# EAGLE design LSM303 breakout board-v12 (EAGLE 5.04)
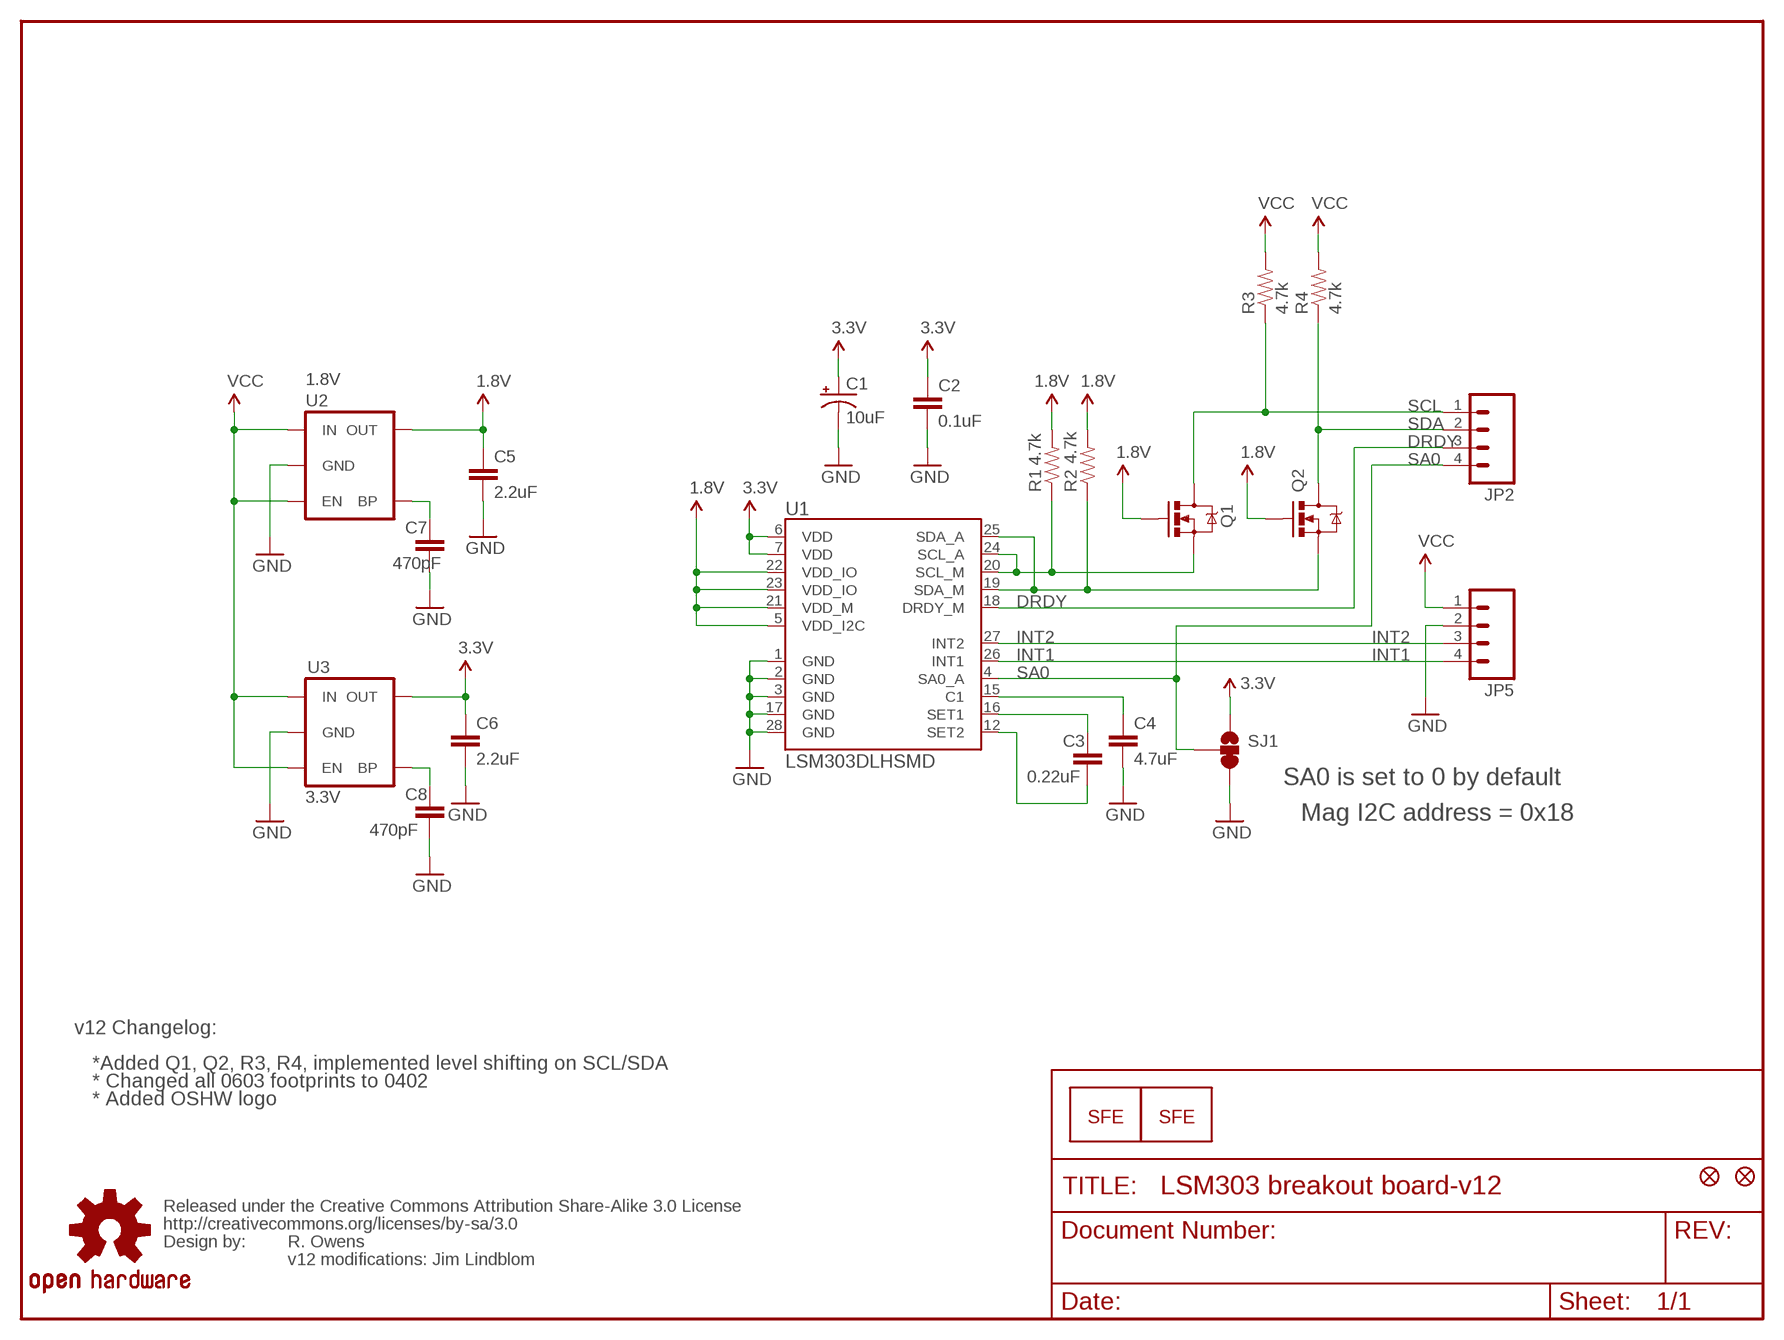
[diagram p0: schematic, sheet 1]

## Parts
C1  10uF  CAP_POL1206  [EIA3216]
C2  0.1uF  CAP0402-CAP  [0402-CAP]
C3  0.22uF  CAP0402-CAP  [0402-CAP]
C4  4.7uF  CAP0402-CAP  [0402-CAP]
C5  2.2uF  CAP0402-CAP  [0402-CAP]
C6  2.2uF  CAP0402-CAP  [0402-CAP]
C7  470pF  CAP0402-CAP  [0402-CAP]
C8  470pF  CAP0402-CAP  [0402-CAP]
JP1  LOGO-SFENW2  [SFE-NEW-WEB]
JP2  M04PTH  [1X04]
JP3  FIDUCIAL1X2  [FIDUCIAL-1X2]
JP4  FIDUCIAL1X2  [FIDUCIAL-1X2]
JP5  M04PTH  [1X04]
JP6  LOGO-SFESK  [SFE-LOGO-FLAME]
Q1  MOSFET-N-CH  MOSFET-NCHANNELSMD  [SOT23-3]
Q2  MOSFET-N-CH  MOSFET-NCHANNELSMD  [SOT23-3]
R1  4.7k  RESISTOR0402-RES  [0402-RES]
R2  4.7k  RESISTOR0402-RES  [0402-RES]
R3  4.7k  RESISTOR0402-RES  [0402-RES]
R4  4.7k  RESISTOR0402-RES  [0402-RES]
SJ1  SOLDERJUMPER_2WAYPASTE2&3  [SJ_3_PASTE2&3]
U1  LSM303DLHSMD  [LGA28-5X5]
U2  1.8V  V_REG_LDOSMD2  [SC70]
U3  3.3V  V_REG_LDOSMD  [SOT23-5]
U$5  CREATIVE_COMMONS  [CREATIVE_COMMONS]
U$8  OSHW-LOGOS  [OSHW-LOGO-S]

## Nets
1.8V: C5.1 Q1.1(G) Q2.1(G) R1.2 R2.2 U1.5(VDD_I2C) U1.21(VDD_M) U1.22(VDD_IO) U1.23(VDD_IO) U2.5(OUT)
3.3V: C1.A(+) C2.1 C6.1 SJ1.1 U1.6(VDD) U1.7(VDD) U3.5(OUT)
DRDY: JP2.3 U1.18(DRDY_M)
GND: C1.C(-) C2.2 C4.2 C5.2 C6.2 C7.2 C8.2 JP5.2 SJ1.3 U1.1(GND) U1.2(GND) U1.3(GND) U1.17(GND) U1.28(GND) U2.2(GND) U3.2(GND)
INT1: JP5.4 U1.26(INT1)
INT2: JP5.3 U1.27(INT2)
N$6: C7.1 U2.4(BP)
N$7: C8.1 U3.4(BP)
N$10: C3.1 U1.16(SET1)
N$11: C3.2 U1.12(SET2)
N$12: C4.1 U1.15(C1)
SA0: JP2.4 SJ1.2 U1.4(SA0_A)
SCL: JP2.1 Q1.3(D) R3.1
SCL_M: Q1.2(S) R1.1 U1.20(SCL_M) U1.24(SCL_A)
SDA: JP2.2 Q2.3(D) R4.1
SDA_M: Q2.2(S) R2.1 U1.19(SDA_M) U1.25(SDA_A)
VCC: JP5.1 R3.2 R4.2 U2.1(IN) U2.3(EN) U3.1(IN) U3.3(EN)

## Notes on the sheet
- SA0 is set to 0 by default
- Mag I2C address = 0x18
- v12 Changelog:
- *Added Q1, Q2, R3, R4, implemented level shifting on SCL/SDA
- * Changed all 0603 footprints to 0402
- * Added OSHW logo
- R. Owens
- v12 modifications: Jim Lindblom

## Library data of the parts
C1 = SparkFun:CAP_POL: Capacitor Polarized These are standard SMD and PTH capacitors. Normally 10uF, 47uF, and 100uF in electrolytic and tantalum varieties. Always verify the external diameter of the through hole cap, it varies with capacity, voltage, and manufacturer. The EIA devices should be standard.
C2-C8 = SparkFun:CAP: Capacitor Standard 0603 ceramic capacitor, and 0.1" leaded capacitor.
JP1 JP6 = SparkFun:LOGO-SFE: Spark Fun Electronics PCB Logo This is the standard Spark Fun Electronics PCB logo.
JP2 JP5 = SparkFun:M04: Header 4 Standard 4-pin 0.1" header. Use with straight break away headers (SKU : PRT-00116), right angle break away headers (PRT-00553), swiss pins (PRT-00743), machine pins (PRT-00117), and female headers (PRT-00115). Molex polarized connector foot print use with SKU : PRT-08231 with associated crimp pins and housings. 1MM SMD Version SKU: PRT-10208
JP3 JP4 = SparkFun:FIDUCIAL: Fiducial Alignment Points Various fiducial points for machine vision alignment.
Q1 Q2 = SparkFun:MOSFET-NCHANNEL
R1-R4 = SparkFun:RESISTOR: Resistor Basic schematic elements and footprints for 0603, 1206, and PTH resistors.
SJ1 = SparkFun:SOLDERJUMPER_2WAY: Solder Jumper 2 way solder jumper
U1 = SparkFun:LSM303DLH
U2 U3 = SparkFun:V_REG_LDO: Voltage Regulator LDO Standard 150mA LDO voltage regulator in SOT-23 layout. Micrel part MIC5205. BP (by-pass) pin is used to lower output noise with 470pF cap.
U$5 = SparkFun:CREATIVE_COMMONS
U$8 = SparkFun:OSHW-LOGO: Open Source Hardware Logo This logo indicates the piece of hardware it is found on incorporates a OSHW license and/or adheres to the definition of open source hardware found here: http://freedomdefined.org/OSHW

## Board
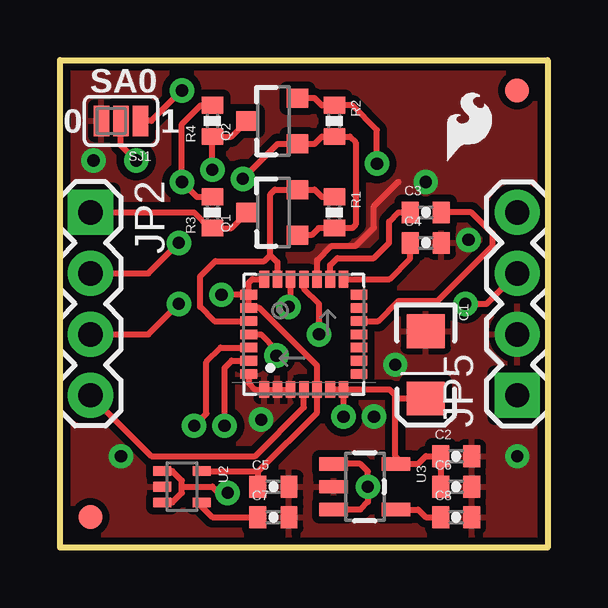
[diagram p1: board, top side]
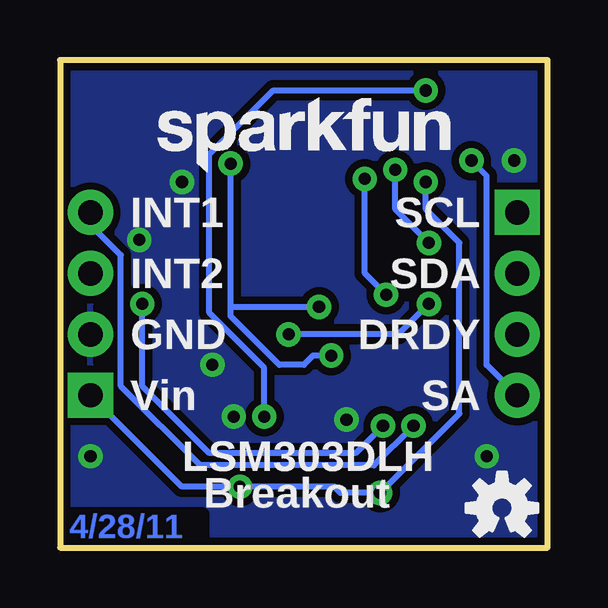
[diagram p2: board, bottom side, seen from below]

Size 20.32 x 20.32 mm. Coordinates in mm from the lower left corner, seen from the top.
Outline: 0,0 0,20.32 20.32,20.32 20.32,0 0,0
Copper layers (1*16): Top 0.035mm / dielectric 1.5mm / Bottom 0.035mm
Design rules "SparkFun *": minimum track width 8mil, minimum drill 20mil, track to track 8mil, track to pad 5mil, pad to pad 5mil, via to via 8mil, smd to smd 5mil, copper to edge 8mil, drill to drill 8mil, minimum pad ring 12mil, minimum via ring 10mil, stop-mask expansion 4mil, vias tented up to drill 20mil, thermal gap 10mil

### Footprints (pad centres in the part's own frame; a part is rotated, then mirrored left to right if it is on the bottom)
EIA3216 = smd 1.4 x 1.6: A 1.4,0; C -1.4,0
0402-CAP = smd 0.7 x 0.9: 1 -0.65,0; 2 0.65,0
1X04 = drill 1.016 pad 1.88 square: 1 0,0 | drill 1.016 pad 1.88 round: 2 2.54,0; 3 5.08,0; 4 7.62,0
FIDUCIAL-1X2 = smd 1 x 1: 1 0,0
SOT23-3 = smd 0.8 x 0.9: 1 -0.95,-1; 2 0.95,-1; 3 0,1.1
0402-RES = smd 0.7 x 0.9: 1 -0.65,0; 2 0.65,0
SJ_3_PASTE2&3 = smd 0.635 x 1.27: 1 -0.813,0; 2 0,0; 3 0.813,0
LGA28-5X5 = smd 0.7 x 0.4: 1 -2.3,1.65; 2 -2.3,1.1; 3 -2.3,0.55; 4 -2.3,0; 5 -2.3,-0.55; 6 -2.3,-1.1; 7 -2.3,-1.65; 15 2.3,-1.65; 16 2.3,-1.1; 17 2.3,-0.55; 18 2.3,0; 19 2.3,0.55; 20 2.3,1.1; 21 2.3,1.65 | smd 0.4 x 0.7: 8 -1.65,-2.3; 9 -1.1,-2.3; 10 -0.55,-2.3; 11 0,-2.3; 12 0.55,-2.3; 13 1.1,-2.3; 14 1.65,-2.3; 22 1.65,2.3; 23 1.1,2.3; 24 0.55,2.3; 25 0,2.3; 26 -0.55,2.3; 27 -1.1,2.3; 28 -1.65,2.3
SC70 = smd 0.4 x 0.75: 1 -0.65,-0.825; 2 0,-0.825; 3 0.65,-0.825; 4 0.65,0.825; 5 -0.65,0.825
SOT23-5 = smd 0.55 x 1.2: 1 -0.95,-1.3; 2 0,-1.3; 3 0.95,-1.3; 4 0.95,1.3; 5 -0.95,1.3

### Placement (x,y rotation side)
C1  15.24,7.62 270 top
C2  16.51,3.81 0 top
C3  15.24,13.97 0 top
C4  15.24,12.7 0 top
C5  8.89,2.54 0 top
C6  16.51,2.54 0 top
C7  8.89,1.27 0 top
C8  16.51,1.27 0 top
JP1  16.26,15.62 0 bottom
JP2  1.27,13.97 270 top
JP3  1.27,1.27 0 top
JP4  19.05,19.05 0 top
JP5  19.05,6.35 90 top
JP6  16.13,16.13 0 top
Q1  8.89,13.97 90 top
Q2  8.89,17.78 90 top
R1  11.43,13.97 270 top
R2  11.43,17.78 270 top
R3  6.35,13.97 90 top
R4  6.35,17.78 90 top
SJ1  2.54,17.78 180 top
U1  10.16,8.89 90 top
U2  5.08,2.54 270 top
U3  12.7,2.54 270 top
U$5  -10.16,-5.08 0 top  (outside the outline)
U$8  1.91,1.65 0 bottom

### Tracks (layer width: path | path; a pad name or v marks a point on that pad's centre or on a via)
1.8V  (via drill 0.51)
  Top 0.254: U1.21 8.02,11.19 7.86,11.04 U1.22 | Q1.1 10.48,13.02 10.78,13.32 R1.2 12.18,13.32 12.32,13.46 12.32,16.89 12.08,17.13 R2.2 10.91,17.13 10.61,16.83 Q2.1 9.08,16.83 v7.62,15.37 | U1.22 | U1.22 v6.73,10.54 | U1.22 U1.23 8.3,9.99 10.71,7.58 U1.5 10.71,5.63 8.27,3.19 | U2.5 8.27,3.19 | C5.1 8.24,3.16 8.27,3.19
  Bottom 0.254: v6.73,10.54 7.62,11.43 v7.62,15.37
3.3V  (via drill 0.51)
  Top 0.254: U1.7 U1.6 | 4.83,18.8 v5.08,19.05 3.81,17.78 SJ1.1 | v11.81,5.46 U1.7 | U1.7 13.73,6.59 13.97,6.35 13.97,6.22 | C1.A 13.97,6.22 | U3.5 14.29,3.49 | 14.29,3.49 13.97,3.81 13.97,6.22 | C6.1 C2.1 15.24,3.81 14.92,3.49 14.29,3.49
  Bottom 0.254: v11.81,5.46 11.81,7.49 14.1,9.78 14.1,16.38 11.43,19.05 v5.08,19.05
DRDY  (via drill 0.51)
  Top 0.254: U1.18 10.16,10.79 10.79,10.16 v10.79,8.89 | JP2.3 3.68,8.89 v4.95,10.16
  Bottom 0.254: v10.79,8.89 6.22,8.89 v4.95,10.16
GND  (via drill 0.51)
  Top 0.254: U1.3 U1.2 U1.1 8.14,6.59 7.86,6.87 U1.28 | U1.17 10.71,11.98 11.3,12.57 12.32,12.57 13.08,13.34 13.08,14.22 14.1,15.24
  other vias: 8.38,5.33 19.05,3.81 2.54,3.81 17.02,12.83 15.24,15.24 13.97,7.62 13.08,5.46 1.4,16.13
  pour Top (isolate 0.305): 0,0 0,20.32 20.32,20.32 20.32,0
  pour Bottom (isolate 0.305): 0,0 0,20.32 20.32,20.32 20.32,0
INT1  (via drill 0.51)
  Top 0.254: U1.26 6.69,8.34 6.1,7.75 6.1,5.59 v5.59,5.08
  Bottom 0.254: v5.59,5.08 7.24,3.43 14.48,3.43 17.78,6.73 17.78,12.19 19.05,13.46 JP5.4
INT2  (via drill 0.51)
  Top 0.254: U1.27 7.16,7.79 6.86,7.49 v6.86,5.08 | v16.89,10.16 17.78,10.16 JP5.3
  Bottom 0.254: v16.89,10.16 16.89,6.73 14.1,3.94 8,3.94 v6.86,5.08
N$6
  Top 0.254: U2.4 5.91,1.72 6.35,1.27 C7.1
N$7
  Top 0.254: U3.4 14.92,1.59 15.24,1.27 C8.1
N$10
  Top 0.254: U1.16 11.26,11.77 11.56,12.06 13.08,12.06 13.72,12.7 13.72,13.59 14.1,13.97 C3.1
N$11
  Top 0.254: U1.12 13.25,9.44 14.1,10.29 15.75,10.29 18.03,12.57 18.03,13.08 17.14,13.97 C3.2
N$12
  Top 0.254: U1.15 13.73,11.19 14.59,12.05 C4.1
SA0  (via drill 0.51)
  Top 0.254: U1.4 10.16,5.84 8.13,3.81 3.81,3.81 JP2.4 | SJ1.2 2.54,16.76 v3.17,16.13
  Bottom 0.254: JP2.4 2.54,7.62 2.54,15.49 v3.17,16.13
SCL
  Top 0.254: Q1.3 7.14,13.32 R3.1 6.24,13.32 5.59,13.97 JP2.1
SCL_M
  Top 0.254: R1.1 10.91,14.62 10.61,14.92 Q1.2 8.95,14.92 8.76,14.73 8.76,12.19 | U1.20 9.06,11.89 8.76,12.19 | 8.76,12.19 8.51,11.94 6.48,11.94 5.84,11.3 5.84,10.03 6.43,9.44 U1.24
SDA  (via drill 0.51)
  Top 0.254: v6.35,15.75 R4.1 7.14,17.13 Q2.3 | JP2.2 3.68,11.43 v4.95,12.7
  Bottom 0.254: v4.95,12.7 6.35,14.1 v6.35,15.75
SDA_M  (via drill 0.51)
  Top 0.254: Q2.2 10.61,18.73 10.91,18.43 R2.1 12.18,18.43 13.21,17.4 v13.21,16 | v9.02,8 9.02,8.26 8.38,8.89 U1.25 | U1.19 9.61,10.12 v9.53,10.03
  Bottom 0.254: 13.21,10.03 13.21,9.65 11.18,7.62 10.16,7.62 9.78,8 v9.02,8 | 13.21,10.03 v13.21,16 | 13.21,10.03 v9.53,10.03
VCC  (via drill 0.51)
  Top 0.254: R4.2 5.86,18.43 5.08,17.65 v5.08,15.24 5.7,14.62 R3.2 | U2.1 4.68,3.19 5.08,2.79 5.08,2.54 | U2.3 4.68,1.89 5.08,2.29 5.08,2.54 | v6.99,2.29 6.6,2.29 6.35,2.54 5.08,2.54 | U3.1 12.51,3.49 12.83,3.17 v12.83,2.54 12.83,1.91 12.51,1.59 U3.3
  Bottom 0.254: JP5.1 15.24,2.54 v12.83,2.54 8.89,2.54 8.64,2.29 v6.99,2.29 3.68,5.59 3.68,12.7 5.08,14.1 v5.08,15.24

### Text on the board
Bottom: 4/28/11
tPlace: SA0 | 0 | 1
bPlace: SCL | INT1 | SDA | INT2 | DRDY | GND | SA | Vin | LSM303DLH | Breakout